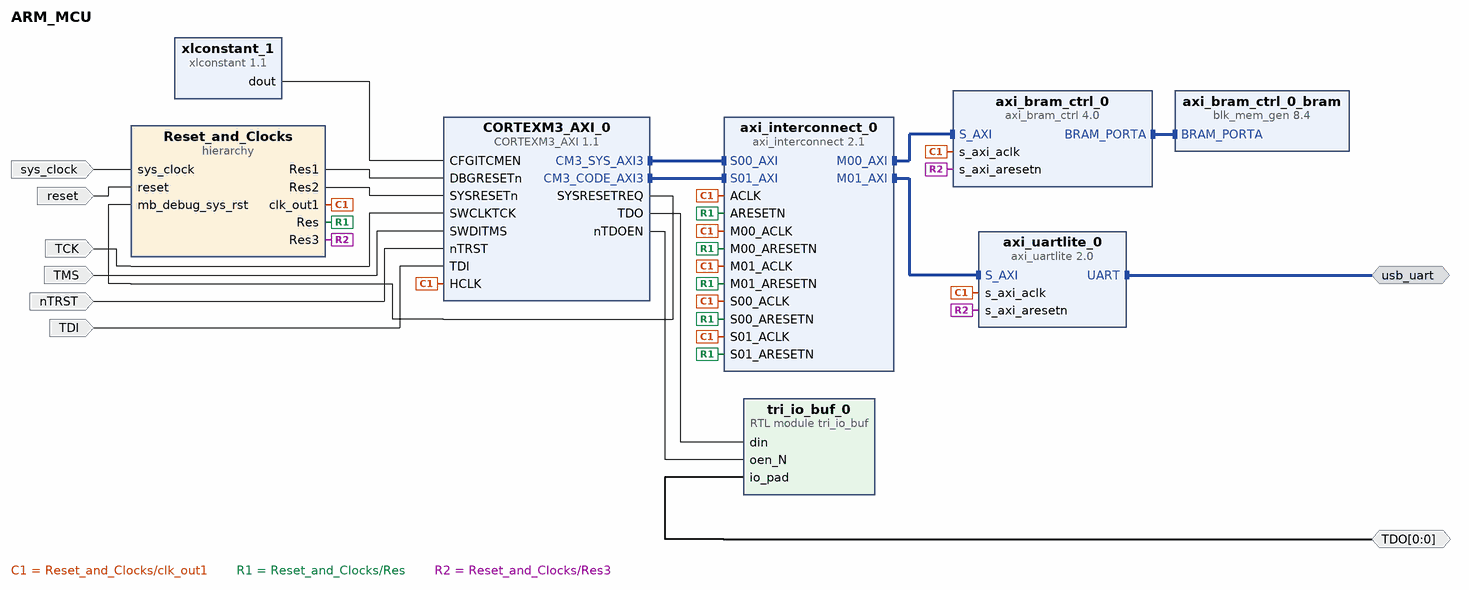
[diagram p0: block diagram of the top level]
# Vivado block design ARM_MCU, xc7a100tcsg324-1, Vivado 2018.2
create_bd_design ARM_MCU

create_bd_intf_port -mode Master -vlnv xilinx.com:interface:uart_rtl:1.0 usb_uart
create_bd_port -dir I -type clk sys_clock
set_property -dict {CONFIG.FREQ_HZ 100000000 CONFIG.PHASE 0.000} [get_bd_ports sys_clock]
create_bd_port -dir I -type rst reset
set_property -dict {CONFIG.POLARITY ACTIVE_HIGH} [get_bd_ports reset]
create_bd_port -dir I -type clk TCK
create_bd_port -dir I TMS
create_bd_port -dir I -type rst nTRST
create_bd_port -dir I TDI
create_bd_port -dir IO -from 0 -to 0 TDO

create_bd_cell -type ip -vlnv Arm.com:CortexM:CORTEXM3_AXI:1.1 CORTEXM3_AXI_0
set_property -dict [list \
  CONFIG.ITCM_INIT_FILE bram_a7.hex \
  CONFIG.MPU_PRESENT false \
  CONFIG.TRACE_LVL 0 \
  CONFIG.DEBUG_LVL 1 \
  CONFIG.BB_PRESENT false \
] [get_bd_cells CORTEXM3_AXI_0]
create_bd_cell -type ip -vlnv xilinx.com:ip:axi_interconnect:2.1 axi_interconnect_0
set_property -dict {CONFIG.NUM_SI 2 CONFIG.NUM_MI 2} [get_bd_cells axi_interconnect_0]
create_bd_cell -type ip -vlnv xilinx.com:ip:xlconstant:1.1 xlconstant_1
set_property -dict {CONFIG.CONST_WIDTH 2} [get_bd_cells xlconstant_1]
create_bd_cell -type ip -vlnv xilinx.com:ip:axi_bram_ctrl:4.0 axi_bram_ctrl_0
set_property -dict {CONFIG.SINGLE_PORT_BRAM 1} [get_bd_cells axi_bram_ctrl_0]
create_bd_cell -type ip -vlnv xilinx.com:ip:blk_mem_gen:8.4 axi_bram_ctrl_0_bram
set_property -dict {CONFIG.EN_SAFETY_CKT false} [get_bd_cells axi_bram_ctrl_0_bram]
create_bd_cell -type hier Reset_and_Clocks
create_bd_cell -type ip -vlnv xilinx.com:ip:axi_uartlite:2.0 axi_uartlite_0
set_property -dict {CONFIG.USE_BOARD_FLOW true CONFIG.UARTLITE_BOARD_INTERFACE usb_uart} [get_bd_cells axi_uartlite_0]
create_bd_cell -type module -reference tri_io_buf tri_io_buf_0

# ---- hierarchy /Reset_and_Clocks ----
current_bd_instance /Reset_and_Clocks
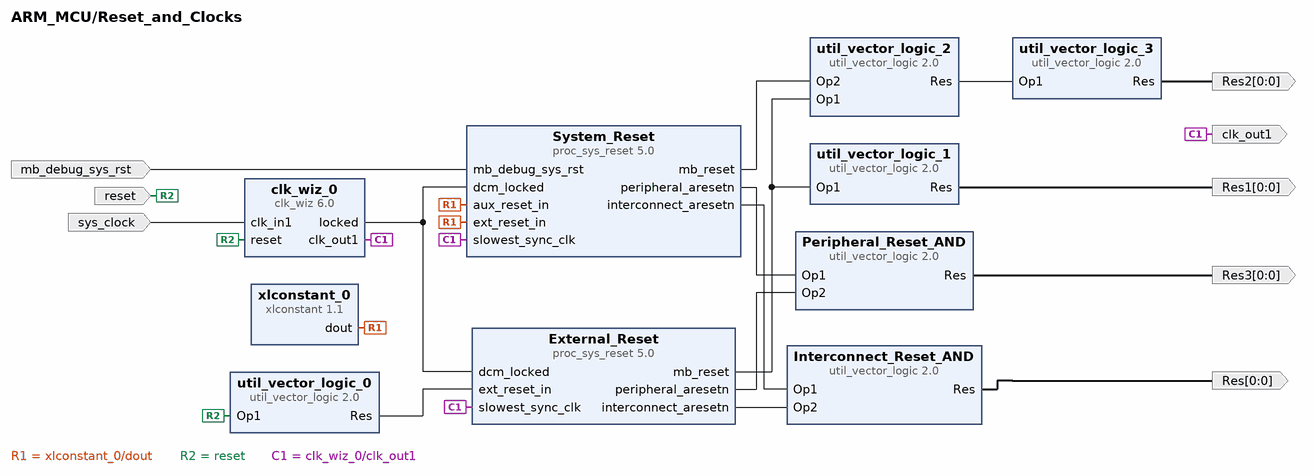
[diagram p1: block diagram inside /Reset_and_Clocks]
create_bd_pin -dir O -from 0 -to 0 Res
create_bd_pin -dir I -type rst reset
create_bd_pin -dir O -from 0 -to 0 Res1
create_bd_pin -dir O -from 0 -to 0 Res2
create_bd_pin -dir O -type clk clk_out1
create_bd_pin -dir I -type rst mb_debug_sys_rst
create_bd_pin -dir I -type clk sys_clock
create_bd_pin -dir O -from 0 -to 0 Res3

create_bd_cell -type ip -vlnv xilinx.com:ip:util_vector_logic:2.0 Interconnect_Reset_AND
set_property -dict {CONFIG.C_SIZE 1} [get_bd_cells Interconnect_Reset_AND]
create_bd_cell -type ip -vlnv xilinx.com:ip:util_vector_logic:2.0 util_vector_logic_0
set_property -dict {CONFIG.C_SIZE 1 CONFIG.C_OPERATION not} [get_bd_cells util_vector_logic_0]
create_bd_cell -type ip -vlnv xilinx.com:ip:util_vector_logic:2.0 util_vector_logic_1
set_property -dict {CONFIG.C_SIZE 1 CONFIG.C_OPERATION not} [get_bd_cells util_vector_logic_1]
create_bd_cell -type ip -vlnv xilinx.com:ip:xlconstant:1.1 xlconstant_0
create_bd_cell -type ip -vlnv xilinx.com:ip:util_vector_logic:2.0 util_vector_logic_2
set_property -dict {CONFIG.C_SIZE 1 CONFIG.C_OPERATION or} [get_bd_cells util_vector_logic_2]
create_bd_cell -type ip -vlnv xilinx.com:ip:util_vector_logic:2.0 util_vector_logic_3
set_property -dict {CONFIG.C_SIZE 1 CONFIG.C_OPERATION not} [get_bd_cells util_vector_logic_3]
create_bd_cell -type ip -vlnv xilinx.com:ip:proc_sys_reset:5.0 System_Reset
create_bd_cell -type ip -vlnv xilinx.com:ip:proc_sys_reset:5.0 External_Reset
create_bd_cell -type ip -vlnv xilinx.com:ip:clk_wiz:6.0 clk_wiz_0
set_property -dict [list \
  CONFIG.CLKOUT1_REQUESTED_OUT_FREQ 50.000 \
  CONFIG.MMCM_DIVCLK_DIVIDE 1 \
  CONFIG.MMCM_CLKOUT0_DIVIDE_F 20.000 \
  CONFIG.USE_BOARD_FLOW true \
  CONFIG.CLK_IN1_BOARD_INTERFACE sys_clock \
  CONFIG.RESET_BOARD_INTERFACE reset \
  CONFIG.CLKOUT1_JITTER 151.636 \
] [get_bd_cells clk_wiz_0]
create_bd_cell -type ip -vlnv xilinx.com:ip:util_vector_logic:2.0 Peripheral_Reset_AND
set_property -dict {CONFIG.C_SIZE 1} [get_bd_cells Peripheral_Reset_AND]

# ---- connections ----

current_bd_instance /Reset_and_Clocks
connect_bd_net [get_bd_pins System_Reset/interconnect_aresetn] [get_bd_pins Interconnect_Reset_AND/Op1]
connect_bd_net [get_bd_pins External_Reset/interconnect_aresetn] [get_bd_pins Interconnect_Reset_AND/Op2]
connect_bd_net [get_bd_pins util_vector_logic_0/Res] [get_bd_pins External_Reset/ext_reset_in]
connect_bd_net [get_bd_pins External_Reset/mb_reset] [get_bd_pins util_vector_logic_1/Op1] [get_bd_pins util_vector_logic_2/Op1]
connect_bd_net [get_bd_pins xlconstant_0/dout] [get_bd_pins System_Reset/ext_reset_in] [get_bd_pins System_Reset/aux_reset_in]
connect_bd_net [get_bd_pins System_Reset/mb_reset] [get_bd_pins util_vector_logic_2/Op2]
connect_bd_net [get_bd_pins util_vector_logic_2/Res] [get_bd_pins util_vector_logic_3/Op1]
connect_bd_net [get_bd_pins clk_wiz_0/locked] [get_bd_pins External_Reset/dcm_locked] [get_bd_pins System_Reset/dcm_locked]
connect_bd_net [get_bd_pins System_Reset/peripheral_aresetn] [get_bd_pins Peripheral_Reset_AND/Op1]
connect_bd_net [get_bd_pins External_Reset/peripheral_aresetn] [get_bd_pins Peripheral_Reset_AND/Op2]
connect_bd_net [get_bd_pins Interconnect_Reset_AND/Res] [get_bd_pins Res]
connect_bd_net [get_bd_pins reset] [get_bd_pins clk_wiz_0/reset] [get_bd_pins util_vector_logic_0/Op1]
connect_bd_net [get_bd_pins util_vector_logic_1/Res] [get_bd_pins Res1]
connect_bd_net [get_bd_pins util_vector_logic_3/Res] [get_bd_pins Res2]
connect_bd_net [get_bd_pins clk_wiz_0/clk_out1] \
  [get_bd_pins clk_out1] [get_bd_pins External_Reset/slowest_sync_clk] [get_bd_pins System_Reset/slowest_sync_clk]
connect_bd_net -net CORTEXM3_AXI_0_SYSRESETREQ [get_bd_pins mb_debug_sys_rst] [get_bd_pins System_Reset/mb_debug_sys_rst]
connect_bd_net [get_bd_pins sys_clock] [get_bd_pins clk_wiz_0/clk_in1]
connect_bd_net [get_bd_pins Peripheral_Reset_AND/Res] [get_bd_pins Res3]

current_bd_instance /
connect_bd_intf_net [get_bd_intf_pins CORTEXM3_AXI_0/CM3_SYS_AXI3] [get_bd_intf_pins axi_interconnect_0/S00_AXI]
connect_bd_intf_net [get_bd_intf_pins CORTEXM3_AXI_0/CM3_CODE_AXI3] [get_bd_intf_pins axi_interconnect_0/S01_AXI]
connect_bd_intf_net [get_bd_intf_pins axi_interconnect_0/M00_AXI] [get_bd_intf_pins axi_bram_ctrl_0/S_AXI]
connect_bd_intf_net [get_bd_intf_pins axi_bram_ctrl_0_bram/BRAM_PORTA] [get_bd_intf_pins axi_bram_ctrl_0/BRAM_PORTA]
connect_bd_intf_net [get_bd_intf_pins axi_interconnect_0/M01_AXI] [get_bd_intf_pins axi_uartlite_0/S_AXI]
connect_bd_intf_net [get_bd_intf_ports usb_uart] [get_bd_intf_pins axi_uartlite_0/UART]
connect_bd_net [get_bd_ports sys_clock] [get_bd_pins Reset_and_Clocks/sys_clock]
connect_bd_net -net clk_wiz_0_clk_out1 [get_bd_pins Reset_and_Clocks/clk_out1] \
  [get_bd_pins CORTEXM3_AXI_0/HCLK] [get_bd_pins axi_bram_ctrl_0/s_axi_aclk] [get_bd_pins axi_uartlite_0/s_axi_aclk] \
  [get_bd_pins axi_interconnect_0/ACLK] [get_bd_pins axi_interconnect_0/S00_ACLK] [get_bd_pins axi_interconnect_0/M00_ACLK] \
  [get_bd_pins axi_interconnect_0/M01_ACLK] [get_bd_pins axi_interconnect_0/S01_ACLK]
connect_bd_net [get_bd_ports reset] [get_bd_pins Reset_and_Clocks/reset]
connect_bd_net [get_bd_pins CORTEXM3_AXI_0/SYSRESETREQ] [get_bd_pins Reset_and_Clocks/mb_debug_sys_rst]
connect_bd_net -net util_vector_logic_1_Res [get_bd_pins Reset_and_Clocks/Res1] [get_bd_pins CORTEXM3_AXI_0/DBGRESETn]
connect_bd_net -net util_vector_logic_3_Res [get_bd_pins Reset_and_Clocks/Res2] [get_bd_pins CORTEXM3_AXI_0/SYSRESETn]
connect_bd_net -net Interconnect_Reset_AND_Res [get_bd_pins Reset_and_Clocks/Res] \
  [get_bd_pins axi_interconnect_0/ARESETN] [get_bd_pins axi_interconnect_0/S00_ARESETN] \
  [get_bd_pins axi_interconnect_0/M00_ARESETN] [get_bd_pins axi_interconnect_0/M01_ARESETN] \
  [get_bd_pins axi_interconnect_0/S01_ARESETN]
connect_bd_net -net SWCLKTCK_0_1 [get_bd_ports TCK] [get_bd_pins CORTEXM3_AXI_0/SWCLKTCK]
connect_bd_net -net SWDITMS_0_1 [get_bd_ports TMS] [get_bd_pins CORTEXM3_AXI_0/SWDITMS]
connect_bd_net -net nTRST_0_1 [get_bd_ports nTRST] [get_bd_pins CORTEXM3_AXI_0/nTRST]
connect_bd_net -net TDI_0_1 [get_bd_ports TDI] [get_bd_pins CORTEXM3_AXI_0/TDI]
connect_bd_net [get_bd_pins xlconstant_1/dout] [get_bd_pins CORTEXM3_AXI_0/CFGITCMEN]
connect_bd_net -net Peripheral_Reset_AND_Res [get_bd_pins Reset_and_Clocks/Res3] \
  [get_bd_pins axi_bram_ctrl_0/s_axi_aresetn] [get_bd_pins axi_uartlite_0/s_axi_aresetn]
connect_bd_net [get_bd_pins CORTEXM3_AXI_0/TDO] [get_bd_pins tri_io_buf_0/din]
connect_bd_net [get_bd_pins CORTEXM3_AXI_0/nTDOEN] [get_bd_pins tri_io_buf_0/oen_N]
connect_bd_net [get_bd_ports TDO] [get_bd_pins tri_io_buf_0/io_pad]

# ---- address map ----
assign_bd_address -offset 0x40600000 -range 64K -target_address_space [get_bd_addr_spaces CORTEXM3_AXI_0/CM3_CODE_AXI3] [get_bd_addr_segs axi_uartlite_0/S_AXI/Reg]
assign_bd_address -offset 0x60000000 -range 8K -target_address_space [get_bd_addr_spaces CORTEXM3_AXI_0/CM3_CODE_AXI3] [get_bd_addr_segs axi_bram_ctrl_0/S_AXI/Mem0]
assign_bd_address -offset 0x40600000 -range 64K -target_address_space [get_bd_addr_spaces CORTEXM3_AXI_0/CM3_SYS_AXI3] [get_bd_addr_segs axi_uartlite_0/S_AXI/Reg]
assign_bd_address -offset 0x60000000 -range 8K -target_address_space [get_bd_addr_spaces CORTEXM3_AXI_0/CM3_SYS_AXI3] [get_bd_addr_segs axi_bram_ctrl_0/S_AXI/Mem0]

validate_bd_design
save_bd_design
